# Altium schematic sheet DPort-ECT Reference Design.SchDoc
size A4; CheckedBy: AIoT事业部; Author: 工控机; DocumentNumber: 1; SheetNumber: 1; SheetTotal: 1; PageSetup: Record=PageOptions|CenterHorizontal=True|CenterVertical=True|PrintScale=1.00|XCorrection=1.00|YCorrection=1.00|PrintKind=0|BorderSize=5000000|LeftOffset=0|BottomOffset=0|Orientation=2|PaperLength=1000|PaperWidth=1000|Scale=100|PaperSource=7|PrintQuality=600|MediaType=1|DitherType=10|PaperKind=A4|PrintScaleMode=1; DesignDate: 2023-12-19; CheckDate: 2023-12-22; SheetName: DPort-ECT 参考设计电路; SheetVersion: Rev.A; SheetDescription: DPort-ECT 参考设计电路; ProductName: 集成式EtherCAT从站模块; ProductModel: DPort-ECT
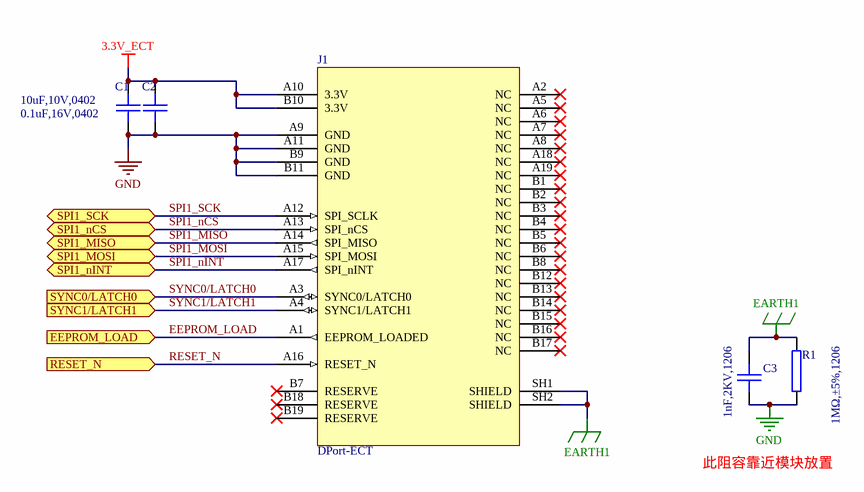
[diagram p0: DPort-ECT Reference Design.SchDoc]

## Parts
C1  10uF,10V,0402  [0402C]
C2  0.1uF,16V,0402  [0402C]
C3  1nF,2KV,1206  [1206C]
J1  DPort-ECT  [DPORT-G]
R1  1MΩ,±5%,1206  [1206R]

## Ports
EEPROM_LOAD (in), RESET_N (in), SPI1_MISO (bidir), SPI1_MOSI (bidir), SPI1_nCS (bidir), SPI1_nINT (bidir), SPI1_SCK (bidir), SYNC0/LATCH0 (in), SYNC1/LATCH1 (in)

## Nets
3.3V_ECT: C1.1 C2.1 J1.A10(3.3V) J1.B10(3.3V)
EARTH1: C3.2 J1.SH1(SHIELD) J1.SH2(SHIELD) R1.2
GND: C1.2 C2.2 C3.1 J1.A9(GND) J1.A11(GND) J1.B9(GND) J1.B11(GND) R1.1
EEPROM_LOAD: J1.A1(EEPROM_LOADED) ; port EEPROM_LOAD
RESET_N: J1.A16(RESET_N) ; port RESET_N
SPI1_MISO: J1.A14(SPI_MISO) ; port SPI1_MISO
SPI1_MOSI: J1.A15(SPI_MOSI) ; port SPI1_MOSI
SPI1_nCS: J1.A13(SPI_nCS) ; port SPI1_nCS
SPI1_nINT: J1.A17(SPI_nINT) ; port SPI1_nINT
SPI1_SCK: J1.A12(SPI_SCLK) ; port SPI1_SCK
SYNC0/LATCH0: J1.A3(SYNC0/LATCH0) ; port SYNC0/LATCH0
SYNC1/LATCH1: J1.A4(SYNC1/LATCH1) ; port SYNC1/LATCH1

Not connected (* = marked no-connect by the designer): J1 A2(NC)* A5(NC)* A6(NC)* A7(NC)* A8(NC)* A18(NC)* A19(NC)* B1(NC)* B2(NC)* B3(NC)* B4(NC)* B5(NC)* B6(NC)* B7(RESERVE)* B8(NC)* B12(NC)* B13(NC)* B14(NC)* B15(NC)* B16(NC)* B17(NC)* B18(RESERVE)* B19(RESERVE)*

## Notes on the sheet
- 此阻容靠近模块放置
- 1
- #
- 修改日期
- 修改内容
- 2
- 3
- 设计人员
- 审核人员
- 设计日期
- 审核日期
- 产品名称
- 图纸名称
- 产品型号
- 图纸描述
- 图纸版本
- A4

## Library data of the parts
C1 = 02.01.00527: GRM155R61A106ME11D,0402,muRata,10uF,X5R,±20%,10V; 名称: 电容; 封装: 0402; 贴片和直插: SMT; 环保状态: RoHS2.0; PCB备注: 200927ZW; 器件优选方案: 通用物料; 生产单位: PCS; 物料代码: 02.01.00527; Value: 10uF,10V,0402; 厂商: MURATA; 型号: GRM155R61A106ME11D,0402,muRata,10uF,X5R,±20%,10V; ComponentLink1Description: ErpDataInfo; ComponentLink1URL: http://doc2/webdisk/物料资料/物料资料/02/01/00/527/数据手册
C2 = 02.01.00513: CC0402KRX7R7BB104,0402,YAGEO,0.1uF,X7R,±10%,16V,; 名称: 电容; 封装: 0402; 贴片和直插: SMT; 环保状态: RoHS2.0; PCB备注: 211228yyj; 器件优选方案: 通用物料; 生产单位: PCS; 物料代码: 02.01.00513; Value: 0.1uF,16V,0402; 厂商: YAGEO; 型号: CC0402KRX7R7BB104,0402,YAGEO,0.1uF,X7R,±10%,16V,; ComponentLink1Description: ErpDataInfo; ComponentLink1URL: http://doc2/webdisk/物料资料/物料资料/02/01/00/513/数据手册
C3 = 02.01.00212: CC1206KKX7RDBB102,1206,YAGEO,1nF,X7R,±10%,2KV,; 名称: 电容; 封装: 1206; 贴片和直插: SMT; 旧物料代码: 1.02.03.0003; 器件优选方案: 不推荐使用; 物料代码: 02.01.00212; Value: 1nF,2KV,1206; 型号: CC1206KKX7RDBB102,1206,YAGEO,1nF,X7R,±10%,2KV,; ComponentLink1Description: ErpDataInfo; ComponentLink1URL: http://doc2/webdisk/物料资料/物料资料/02/01/00/212/数据手册
R1 = 01.01.00041: RTT06105JTP,1206,RALEC,1MΩ,±5%,1/4W,; 名称: 电阻; 封装: 1206; 贴片和直插: SMT; 旧物料代码: 1.01.03.0019; 器件优选方案: 通用物料; 物料代码: 01.01.00041; Value: 1MΩ,±5%,1206; ComponentLink1Description: ErpDataInfo; ComponentLink1URL: http://doc2/webdisk/物料资料/物料资料/01/01/00/041/数据手册; 型号: RTT06105JTP,1206,RALEC,1MΩ,±5%,1/4W,